# Altium schematic sheet Sheet_3_nizovie.SchDoc
size A4
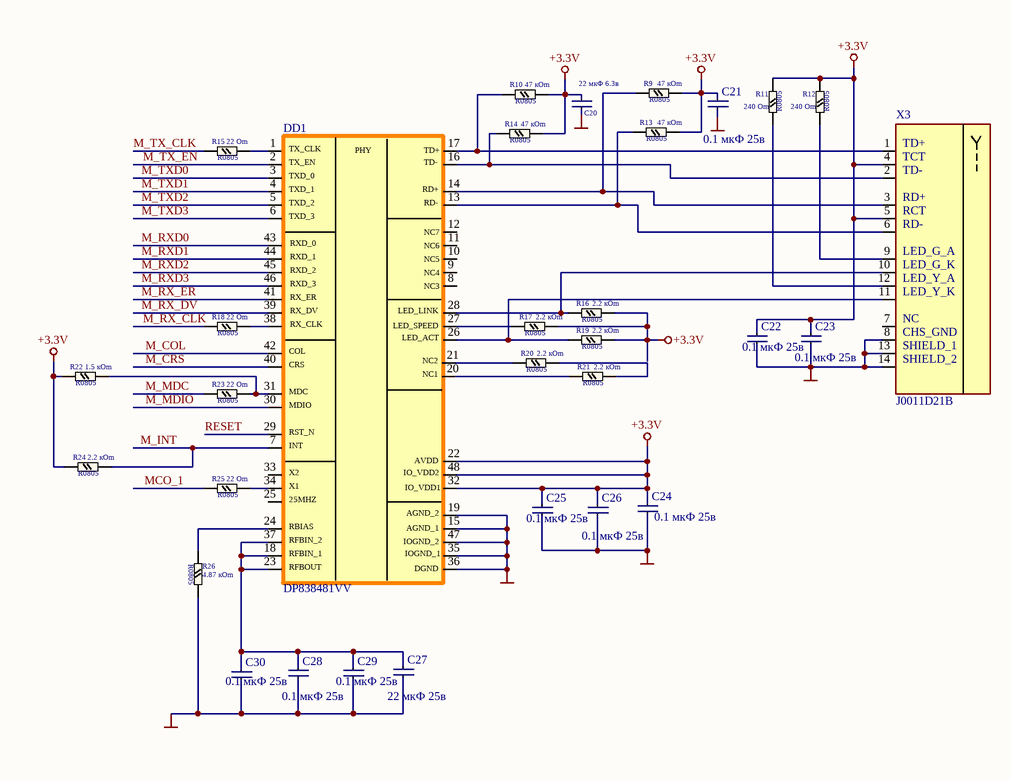
[diagram p0: Sheet_3_nizovie.SchDoc]

## Parts
C20  22 мкФ 6.3в  [FP_0805]
C21  0.1 мкФ 25в  [FP_0805]
C22  0.1 мкФ 25в  [FP_0805]
C23  0.1 мкФ 25в  [FP_0805]
C24  0.1 мкФ 25в  [FP_0805]
C25  0.1 мкФ 25в  [FP_0805]
C26  0.1 мкФ 25в  [FP_0805]
C27  22 мкФ 25в  [FP_0805]
C28  0.1 мкФ 25в  [FP_0805]
C29  0.1 мкФ 25в  [FP_0805]
C30  0.1 мкФ 25в  [FP_0805]
DD1  DP838481VV  [TSQFP50P905X905X140-48N]
R9  47 кОm  [FP_0805]
R10  47 кОm  [FP_0805]
R11  240 Оm  [FP_0805]
R12  240 Оm  [FP_0805]
R13  47 кОm  [FP_0805]
R14  47 кОm  [FP_0805]
R15  22 Оm  [FP_0805]
R16  2.2 кОm  [FP_0805]
R17  2.2 кОm  [FP_0805]
R18  22 Оm  [FP_0805]
R19  2.2 кОm  [FP_0805]
R20  2.2 кОm  [FP_0805]
R21  2.2 кОm  [FP_0805]
R22  1.5 кОm  [FP_0805]
R23  22 Оm  [FP_0805]
R24  2.2 кОm  [FP_0805]
R25  22 Оm  [FP_0805]
R26  4.87 кОm  [FP_0805]
X3  J0011D21B  [J0006D21BNL]

## Nets
+3.3V: C20.2 C21.2 C22.2 C23.2 C24.2 C25.2 C26.2 DD1.22 DD1.32 DD1.48 R9.2 R10.2 R11.2 R12.2 R13.2 R14.2 R16.2 R17.2 R19.2 R22.1 R24.1 X3.4 X3.5
GND: C20.1 C21.1 C22.1 C23.1 C24.1 C25.1 C26.1 C27.1 C28.1 C29.1 C30.1 DD1.15 DD1.19 DD1.35 DD1.36 DD1.47 R26.2 X3.8 X3.13 X3.14
M_COL: DD1.42
M_CRS: DD1.40
M_INT: DD1.7 R24.2
M_MDC: R23.1
M_MDIO: DD1.30
M_RX_CLK: R18.1
M_RX_DV: DD1.39
M_RX_ER: DD1.41
M_RXD0: DD1.43
M_RXD1: DD1.44
M_RXD2: DD1.45
M_RXD3: DD1.46
M_TX_CLK: R15.1
M_TX_EN: DD1.2
M_TXD0: DD1.3
M_TXD1: DD1.4
M_TXD2: DD1.5
M_TXD3: DD1.6
MCO_1: R25.1
RESET: DD1.29
NetC27_2: C27.2 C28.2 C29.2 C30.2 DD1.18 DD1.23 DD1.37
NetDD1_1: DD1.1 R15.2
NetDD1_13: DD1.13 R13.1 X3.6
NetDD1_14: DD1.14 R9.1 X3.3
NetDD1_16: DD1.16 R14.1 X3.2
NetDD1_17: DD1.17 R10.1 X3.1
NetDD1_20: DD1.20 R21.1
NetDD1_21: DD1.21 R20.1
NetDD1_24: DD1.24 R26.1
NetDD1_26: DD1.26 R19.1 X3.11
NetDD1_27: DD1.27 R17.1
NetDD1_28: DD1.28 R16.1 X3.10
NetDD1_31: DD1.31 R22.2 R23.2
NetDD1_34: DD1.34 R25.2
NetDD1_38: DD1.38 R18.2
NetR11_1: R11.1 X3.12
NetR12_1: R12.1 X3.9
NetR20_2: R20.2 R21.2

Not connected (* = marked no-connect by the designer): DD1 8 9 10 11 12 25 33; X3 7

## Notes on the sheet
- (in symbol DP838481VV) TX_CLK; PHY; TD+; TX_EN; TD-; TXD_0; TXD_1; RD+; TXD_2; RD-; TXD_3; NC7; RXD_0; NC6; RXD_1; NC5; RXD_2; NC4; RXD_3; NC3; RX_ER; RX_DV; LED_LINK; RX_CLK; LED_SPEED; LED_ACT; COL; CRS; NC2; NC1; MDC; MDIO; RST_N; INT; AVDD; X2; IO_VDD2; X1; IO_VDD1; 25MHZ; AGND_2; RBIAS; AGND_1; RFBIN_2; IOGND_2; RFBIN_1; IOGND_1; RFBOUT; DGND
- (in symbol J0011D21B) TD+; TCT; TD-; RD+; RCT; RD-; LED_G_A; LED_G_K; LED_Y_A; LED_Y_K; NC; CHS_GND; SHIELD_1; SHIELD_2

## Library data of the parts
C20-C30 = C0805
R9-R26 = R0805